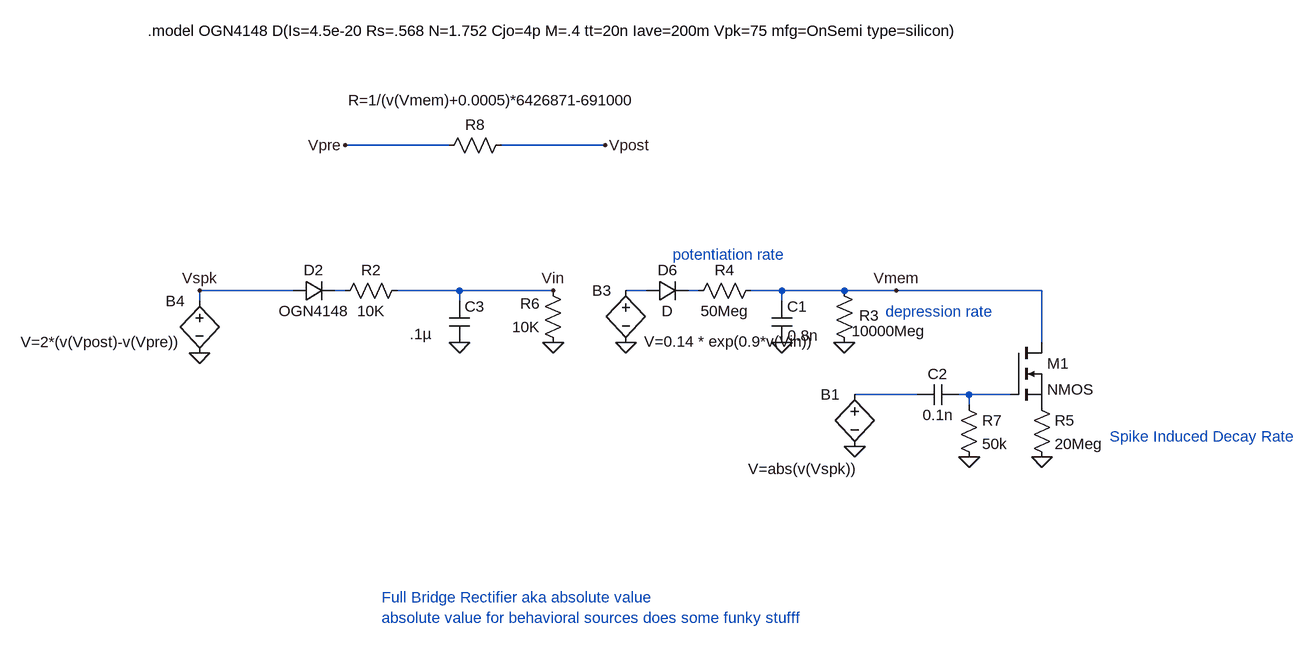
[diagram p0: schematic Synapse.asc]
Synapse.asc, the LTspice schematic file:
Version 4
SHEET 1 2576 1444
WIRE 336 416 176 416
WIRE 576 416 416 416
WIRE 96 640 -48 640
WIRE 176 640 160 640
WIRE 352 640 256 640
WIRE 496 640 352 640
WIRE 640 640 608 640
WIRE 720 640 704 640
WIRE 848 640 800 640
WIRE 944 640 848 640
WIRE 1024 640 944 640
WIRE 1248 640 1024 640
WIRE -48 656 -48 640
WIRE 352 656 352 640
WIRE 848 656 848 640
WIRE 1248 720 1248 640
WIRE 1056 800 960 800
WIRE 1136 800 1120 800
WIRE 1200 800 1136 800
WIRE 1136 816 1136 800
FLAG -48 736 0
FLAG 176 416 Vpre
FLAG 576 416 Vpost
FLAG 352 720 0
FLAG 496 720 0
FLAG 496 640 Vin
FLAG -48 640 Vspk
FLAG 960 880 0
FLAG 944 720 0
FLAG 848 720 0
FLAG 608 720 0
FLAG 1248 896 0
FLAG 1136 896 0
FLAG 1024 640 Vmem
SYMBOL res 512 736 R180
WINDOW 0 36 76 Left 2
WINDOW 3 36 40 Left 2
SYMATTR InstName R6
SYMATTR Value 10K
SYMBOL bv -48 640 R0
WINDOW 0 -52 16 Left 2
WINDOW 3 -275 79 Left 2
SYMATTR InstName B4
SYMATTR Value V=2*(v(Vpost)-v(Vpre))
SYMBOL res 432 400 R90
WINDOW 0 0 56 VBottom 2
WINDOW 3 -69 27 VTop 2
SYMATTR InstName R8
SYMATTR Value R=1/(v(Vmem)+0.0005)*6426871-691000
SYMBOL cap 336 656 R0
WINDOW 3 -61 51 Left 2
SYMATTR Value .1µ
SYMATTR InstName C3
SYMATTR SpiceLine V=16 Irms=7.41 Rser=0.000 Lser=0
SYMBOL diode 96 656 R270
WINDOW 0 32 32 VTop 2
WINDOW 3 0 32 VBottom 2
SYMATTR InstName D2
SYMATTR Value OGN4148
SYMBOL res 272 624 R90
WINDOW 0 0 56 VBottom 2
WINDOW 3 32 56 VTop 2
SYMATTR InstName R2
SYMATTR Value 10K
SYMBOL bv 960 784 R0
WINDOW 0 -52 16 Left 2
WINDOW 3 -164 130 Left 2
SYMATTR InstName B1
SYMATTR Value V=abs(v(Vspk))
SYMBOL cap 832 656 R0
WINDOW 3 25 53 Left 2
SYMATTR Value 0.8n
SYMATTR InstName C1
SYMATTR SpiceLine V=16 Irms=7.41 Rser=0.000 Lser=0
SYMBOL res 960 736 R180
WINDOW 0 -38 58 Left 2
WINDOW 3 -110 34 Left 2
SYMATTR InstName R3
SYMATTR Value 10000Meg
SYMBOL res 816 624 R90
WINDOW 0 0 56 VBottom 2
WINDOW 3 32 56 VTop 2
SYMATTR InstName R4
SYMATTR Value 50Meg
SYMBOL bv 608 624 R0
WINDOW 0 -52 16 Left 2
WINDOW 3 28 94 Left 2
SYMATTR InstName B3
SYMATTR Value V=0.14 * exp(0.9*v(Vin))
SYMBOL nmos 1200 720 R0
SYMATTR InstName M1
SYMBOL res 1232 800 R0
SYMATTR InstName R5
SYMATTR Value 20Meg
SYMBOL cap 1120 784 R90
WINDOW 0 0 32 VBottom 2
WINDOW 3 32 32 VTop 2
SYMATTR InstName C2
SYMATTR Value 0.1n
SYMBOL res 1120 800 R0
SYMATTR InstName R7
SYMATTR Value 50k
SYMBOL diode 640 656 R270
WINDOW 0 32 32 VTop 2
WINDOW 3 0 32 VBottom 2
SYMATTR InstName D6
TEXT -128 240 Left 2 !.model OGN4148 D(Is=4.5e-20 Rs=.568 N=1.752 Cjo=4p M=.4 tt=20n Iave=200m Vpk=75 mfg=OnSemi type=silicon)
TEXT 680 584 Left 2 ;potentiation rate
TEXT 1008 672 Left 2 ;depression rate
TEXT 1352 864 Left 2 ;Spike Induced Decay Rate
TEXT 232 1112 Left 2 ;Full Bridge Rectifier aka absolute value\nabsolute value for behavioral sources does some funky stufff

The netlist it stands for:
* Synapse.asc
R6 0 Vin 10K
B4 Vspk 0 V=2*(v(Vpost)-v(Vpre))
R8 Vpost Vpre R=1/(v(Vmem)+0.0005)*6426871-691000
C3 Vin 0 .1µ V=16 Irms=7.41 Rser=0.000 Lser=0
D2 Vspk N001 OGN4148
R2 Vin N001 10K
B1 N004 0 V=abs(v(Vspk))
C1 Vmem 0 0.8n V=16 Irms=7.41 Rser=0.000 Lser=0
R3 0 Vmem 10000Meg
R4 Vmem N003 50Meg
B3 N002 0 V=0.14 * exp(0.9*v(Vin))
M1 Vmem N005 P001 P001 NMOS
R5 P001 0 20Meg
C2 N005 N004 0.1n
R7 N005 0 50k
D6 N002 N003 D
.model D D
.lib standard.dio
.model NMOS NMOS
.model PMOS PMOS
.lib standard.mos
.model OGN4148 D(Is=4.5e-20 Rs=.568 N=1.752 Cjo=4p M=.4 tt=20n Iave=200m Vpk=75 mfg=OnSemi type=silicon)
* potentiation rate
* depression rate
* Spike Induced Decay Rate
* Full Bridge Rectifier aka absolute value
* absolute value for behavioral sources does some funky stufff
.backanno
.end